# EAGLE design blinkyboard (EAGLE 9.6.1)
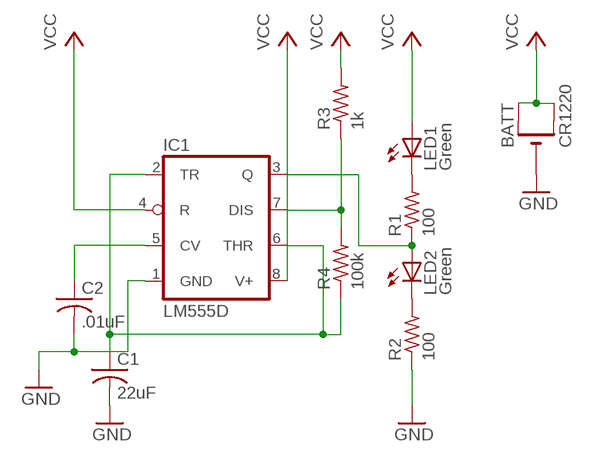
[diagram p0: schematic, sheet 1]

## Parts
BATT  CR1220  CR1220SMT  [CR1220-SMD]
C1  22uF  C-USC0805  [C0805]
C2  .01uF  C-USC0805  [C0805]
IC1  LM555D  [SO08]
LED1  Green  LEDCHIPLED_0805  [CHIPLED_0805]
LED2  Green  LEDCHIPLED_0805  [CHIPLED_0805]
R1  100  R-US_R0805  [R0805]
R2  100  R-US_R0805  [R0805]
R3  1k  R-US_R0805  [R0805]
R4  100k  R-US_R0805  [R0805]

## Nets
GND: BATT.- C1.2 C2.2 IC1.1(GND) R2.1
N$1: LED1.C R1.2
N$2: IC1.3(Q) LED2.A R1.1
N$3: LED2.C R2.2
N$4: IC1.7(DIS) R3.1 R4.2
N$6: C2.1 IC1.5(CV)
N$7: C1.1 IC1.2(TR) IC1.6(THR) R4.1
VCC: BATT.+$1(+) BATT.+$2(+1) IC1.4(R) IC1.8(V+) LED1.A R3.2

## Library data of the parts
BATT = adafruit:CR1220: CR1216/CR1220/CR1225 12mm 3V lithium coin cell Great for battery packup. Both SMT and THM holders. Note the THM package has the ground pads on both sides of the PCB so that the masks are the same - this reduces the cost; MF: KEYSTONE; MPN: 3080; OC_NEWARK: 25T0433
C1 = adafruit:C-US: CAPACITOR, American symbol; MF: AVX; MPN: 06035C224KAT2A; OC_NEWARK: 50AH3283
C2 = adafruit:C-US: CAPACITOR, American symbol; MF: NTE ELECTRONICS; MPN: CML103J100; OC_NEWARK: 33C4450
IC1 = adafruit:*555: TIMER Changed DIP package to have round (not oval) pin pads http://www.ladyada.net/library/pcb/eaglelibrary.html; MF: TEXAS INSTRUMENTS; MPN: TLC555CDR; OC_NEWARK: 33AH5036
LED1 LED2 = adafruit:LED: LED OSRAM: - CHIPLED LG R971, LG N971, LY N971, LG Q971, LY Q971, LO R971, LY R971 LH N974, LH R974 LS Q976, LO Q976, LY Q976 LO Q996 - Hyper CHIPLED LW Q18S LB Q993, LB Q99A, LB R99A - SideLED LS A670, LO A670, LY A670, LG A670, LP A670 LB A673, LV A673, LT A673, LW A673 LH A674 LY A675 LS A676, LA A676, LO A676, LY A676, LW A676 LS A679, LY A679, LG A679 - Hyper Micro SIDELED® LS Y876, LA Y876, LO Y876, LY Y876 LT Y87S - SmartLED LW L88C, LW L88S LB L89C, LB L89S, LG L890 LS L89K, LO L89K, LY L89K LS L896, LA L896, LO L896, LY L896 - TOPLED LS T670, LO T670, LY T670, LG T670, LP T670 LSG T670, LSP T670, LSY T670, LOP T670, LYG T670 LG T671, LOG T671, LSG T671 LB T673, LV T673, LT T673, LW T673 LH T674 LS T676, LA T676, LO T676, LY T676, LB T676, LH T676, LSB T676, LW T676 LB T67C, LV T67C, LT T67C, LS T67K, LO T67K, LY T67K, LW E67C LS E67B, LA E67B, LO E67B, LY E67B, LB E67C, LV E67C, LT E67C LW T67C LS T679, LY T679, LG T679 LS T770, LO T770, LY T770, LG T770, LP T770 LB T773, LV T773, LT T773, LW T773 LH T774 LS E675, LA E675, LY E675, LS T675 LS T776, LA T776, LO T776, LY T776, LB T776 LHGB T686 LT T68C, LB T68C - Hyper Mini TOPLED® LB M676 - Mini TOPLED Santana® LG M470 LS M47K, LO M47K, LY M47K Source: http://www.osram.convergy.de/; MF: LUMEX; MPN: SML-LX0805SUGC-TR; OC_NEWARK: 19J8848
R1 R2 = adafruit:R-US_: RESISTOR, American symbol; MF: VISHAY; MPN: CRCW0805100RJNEA; OC_NEWARK: 01H7765
R3 = adafruit:R-US_: RESISTOR, American symbol; MF: VISHAY; MPN: CRCW08051K00FKEB; OC_NEWARK: 26R4044
R4 = adafruit:R-US_: RESISTOR, American symbol; MF: MULTICOMP PRO; MPN: MCHP05W4F1003T5E; OC_NEWARK: 01N6990

## Net classes
0 default: width 0.305 mm, drill 0.508 mm, clearance 0.254 mm

## Board
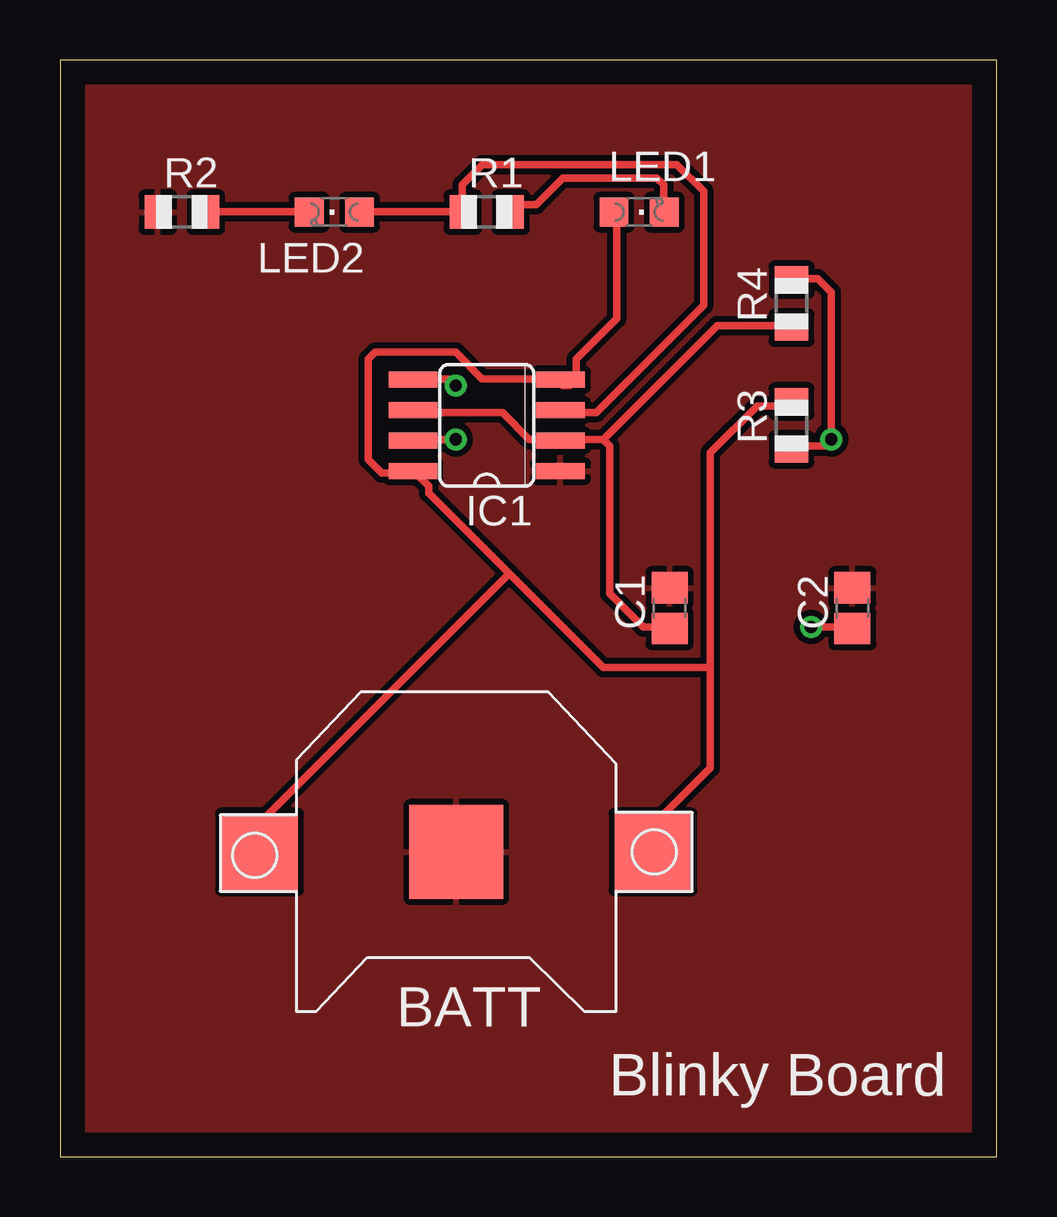
[diagram p1: board, top side]
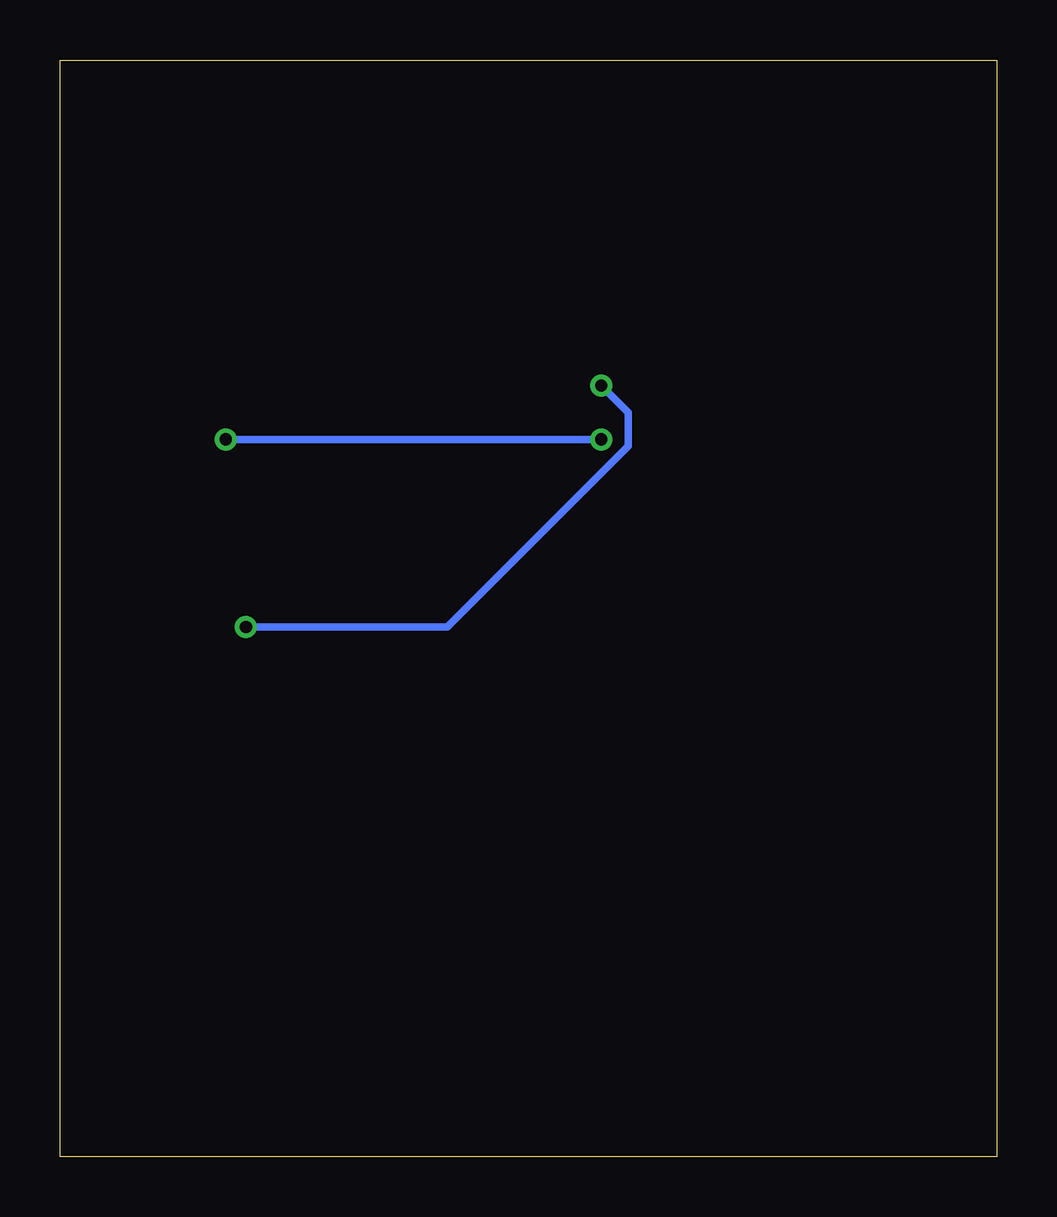
[diagram p2: board, bottom side, seen from below]

Size 39.04 x 45.71 mm. Coordinates in mm from the lower left corner, seen from the top.
Outline: 0,0 39.04,0 39.04,45.71 0,45.71 0,0
Copper layers (1*16): Top 0.035mm / dielectric 1.5mm / Bottom 0.035mm
Design rules "default": minimum track width 6mil, minimum drill 0.35mm, track to track 6mil, track to pad 6mil, pad to pad 6mil, via to via 6mil, smd to smd 6mil, copper to edge 40mil, drill to drill 6mil, minimum pad ring 10mil, minimum via ring 8mil, stop-mask expansion 4mil, vias tented up to drill 0mil, thermal gap 10mil

### Footprints (pad centres in the part's own frame; a part is rotated, then mirrored left to right if it is on the bottom)
CR1220-SMD = smd 3.2 x 3.2: +$1 -8.2,0; +$2 8.2,0 | smd 3.9 x 3.9: - 0,0
C0805 = smd 1.3 x 1.5: 1 -0.85,0; 2 0.85,0
SO08 = smd 0.66 x 2.032: 1 -1.905,-3.073; 2 -0.635,-3.073; 3 0.635,-3.073; 4 1.905,-3.073; 5 1.905,3.073; 6 0.635,3.073; 7 -0.635,3.073; 8 -1.905,3.073
CHIPLED_0805 = smd 1.2 x 1.2: A 0,-1.05; C 0,1.05
R0805 = smd 1.1 x 1.4: 1 -1,0; 2 1,0

### Placement (x,y rotation side)
BATT  16.51,12.7 180 top
C1  25.4,22.86 90 top
C2  33.02,22.86 90 top
IC1  17.78,30.48 90 top
LED1  24.13,39.37 270 top
LED2  11.43,39.37 90 top
R1  17.78,39.37 0 top
R2  5.08,39.37 0 top
R3  30.48,30.48 90 top
R4  30.48,35.56 90 top

### Tracks (layer width: path | path; a pad name or v marks a point on that pad's centre or on a via)
GND
  pour Top: -1.27,46.99 39.37,46.99 39.37,-2.54 -1.27,-2.54
N$1
  Top 0.305: LED1.C 25.15,39.4 25.15,40.51 24.87,40.79 20.95,40.79 19.84,39.67 19,39.67 18.72,39.4 R1.2
N$2
  Top 0.305: 16.76,39.4 12.57,39.4 LED2.A | 16.76,39.4 16.76,40.51 17.6,41.35 25.7,41.35 26.82,40.23 26.82,35.48 22.35,31.01 20.95,31.01 IC1.3 | 16.76,39.4 R1.1
N$3
  Top 0.305: LED2.C 10.34,39.4 6.15,39.4 R2.2
N$4  (via drill 0.51)
  Top 0.305: R3.1 30.73,29.62 31.85,29.62 v32.13,29.9 32.13,36.04 31.57,36.6 30.73,36.6 R4.2 | v16.48,29.9 14.81,29.9 IC1.7
  Bottom 0.305: v32.13,29.9 v16.48,29.9
N$6  (via drill 0.51)
  Top 0.305: v31.29,22.07 32.97,22.07 C2.1 | v16.48,32.13 16.2,32.41 14.81,32.41 IC1.5
  Bottom 0.305: v31.29,22.07 22.91,22.07 15.37,29.62 15.37,31.01 v16.48,32.13
N$7
  Top 0.305: 22.63,29.9 27.38,34.65 30.45,34.65 R4.1 | 22.63,29.9 20.95,29.9 IC1.2 20.68,29.9 19.56,29.9 18.44,31.01 14.81,31.01 IC1.6 | 22.63,29.9 22.91,29.62 22.91,23.47 24.31,22.07 25.15,22.07 C1.1
VCC
  Top 0.305: LED1.A 23.19,39.12 23.19,34.92 21.51,33.25 21.51,32.41 21.23,32.13 20.95,32.13 IC1.4 20.68,32.41 17.6,32.41 16.48,33.53 13.13,33.53 12.85,33.25 12.85,29.06 13.41,28.5 14.53,28.5 IC1.8 14.81,28.5 15.37,27.94 15.37,27.66 18.72,24.31 | 27.1,20.4 27.1,16.2 24.87,13.97 24.87,12.85 BATT.+$1 | 27.1,20.4 27.1,29.34 29.06,31.29 30.45,31.29 R3.2 | 18.72,24.31 22.63,20.4 27.1,20.4 | 18.72,24.31 8.38,13.97 8.38,12.85 BATT.+$2

### Text on the board
tPlace: Blinky Board